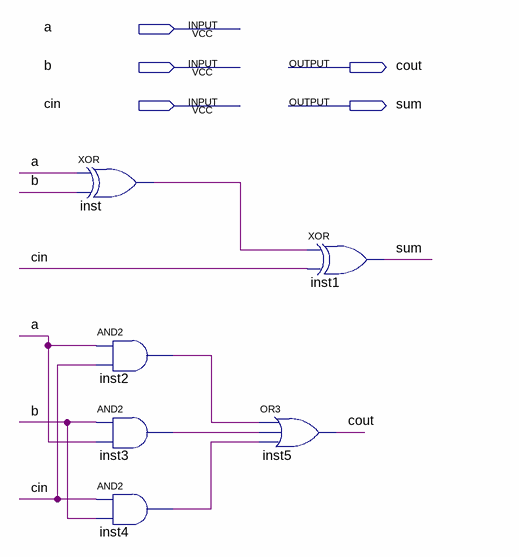
[diagram p0: schematic sheet]
// Quartus schematic lab01proj.bdf as structural Verilog: 6 symbols, 5 pins
module lab01proj (
  input  a,
  input  b,
  input  cin,
  output cout,
  output sum
);

  wire inst2_out, inst3_out, inst4_out, inst_out;

  xor inst (inst_out, a, b);
  and inst2 (inst2_out, a, cin);
  and inst3 (inst3_out, b, a);
  and inst4 (inst4_out, cin, b);
  or inst5 (cout, inst2_out, inst3_out, inst4_out);
  xor inst1 (sum, inst_out, cin);
endmodule
